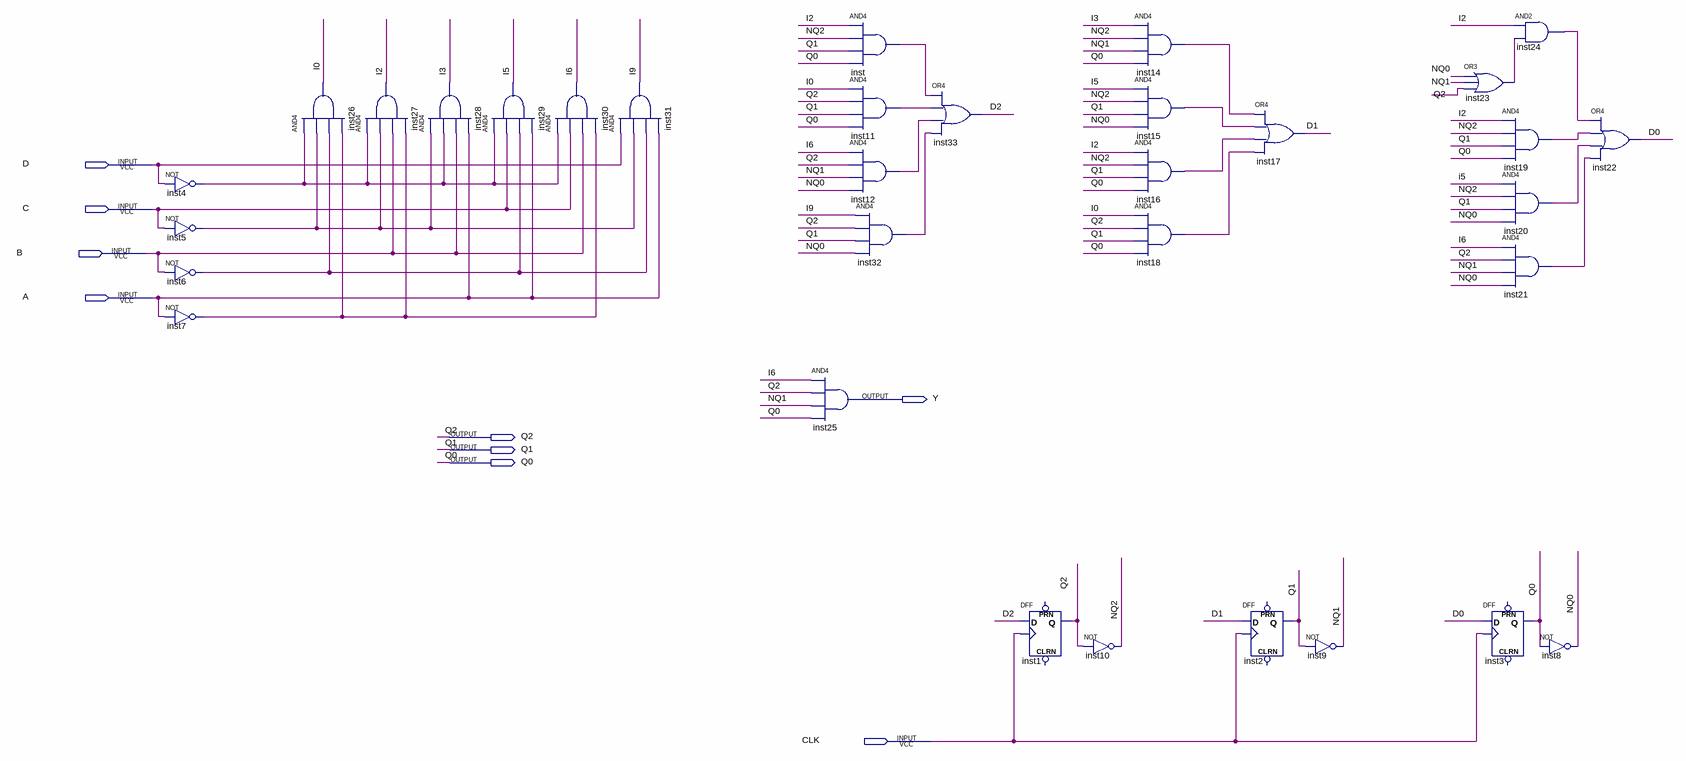
[diagram p0: schematic sheet]
// Quartus schematic MSSV_MEALY.bdf as structural Verilog: 33 symbols, 9 pins
module MSSV_MEALY (
  input  D,
  input  C,
  input  B,
  input  A,
  input  CLK,
  output Y,
  output Q2,
  output Q1,
  output Q0
);

  wire D0, D1, D2, I0, I2, I3, I5, I6, I9, inst4_out, inst5_out, inst6_out, inst7_out, inst11_out,
       inst12_out, inst14_out, inst15_out, inst16_out, inst18_out, inst19_out, inst20_out, inst21_out,
       inst23_out, inst24_out, inst32_out, inst_out, NQ0, NQ1, NQ2;

  not inst4 (inst4_out, D);
  not inst5 (inst5_out, C);
  not inst6 (inst6_out, B);
  not inst7 (inst7_out, A);
  and inst26 (I0, inst4_out, inst5_out, inst6_out, inst7_out);
  and inst27 (I2, inst4_out, inst5_out, B, inst7_out);
  and inst28 (I3, inst5_out, inst4_out, B, A);
  and inst29 (I5, inst4_out, C, inst6_out, A);
  and inst30 (I6, inst4_out, C, B, inst7_out);
  and inst31 (I9, D, inst5_out, inst6_out, A);
  and inst25 (Y, I6, Q2, NQ1, Q0);
  and inst (inst_out, I2, NQ2, Q1, Q0);
  and inst11 (inst11_out, I0, Q2, Q1, Q0);
  and inst12 (inst12_out, I6, Q2, NQ1, NQ0);
  and inst32 (inst32_out, I9, Q2, Q1, NQ0);
  or inst33 (D2, inst_out, inst11_out, inst12_out, inst32_out);
  DFF inst1 (.CLK(CLK), .D(D2), .Q(Q2));  // open: CLRN, PRN
  not inst10 (NQ2, Q2);
  and inst14 (inst14_out, I3, NQ2, NQ1, Q0);
  and inst15 (inst15_out, I5, NQ2, Q1, NQ0);
  and inst16 (inst16_out, I2, NQ2, Q1, Q0);
  and inst18 (inst18_out, I0, Q2, Q1, Q0);
  or inst17 (D1, inst14_out, inst15_out, inst16_out, inst18_out);
  DFF inst2 (.CLK(CLK), .D(D1), .Q(Q1));  // open: CLRN, PRN
  not inst9 (NQ1, Q1);
  or inst23 (inst23_out, NQ0, NQ1, Q2);
  and inst24 (inst24_out, I2, inst23_out);
  and inst19 (inst19_out, I2, NQ2, Q1, Q0);
  and inst20 (inst20_out, I5, NQ2, Q1, NQ0);
  and inst21 (inst21_out, I6, Q2, NQ1, NQ0);
  DFF inst3 (.CLK(CLK), .D(D0), .Q(Q0));  // open: CLRN, PRN
  not inst8 (NQ0, Q0);
  or inst22 (D0, inst24_out, inst19_out, inst20_out, inst21_out);
endmodule
